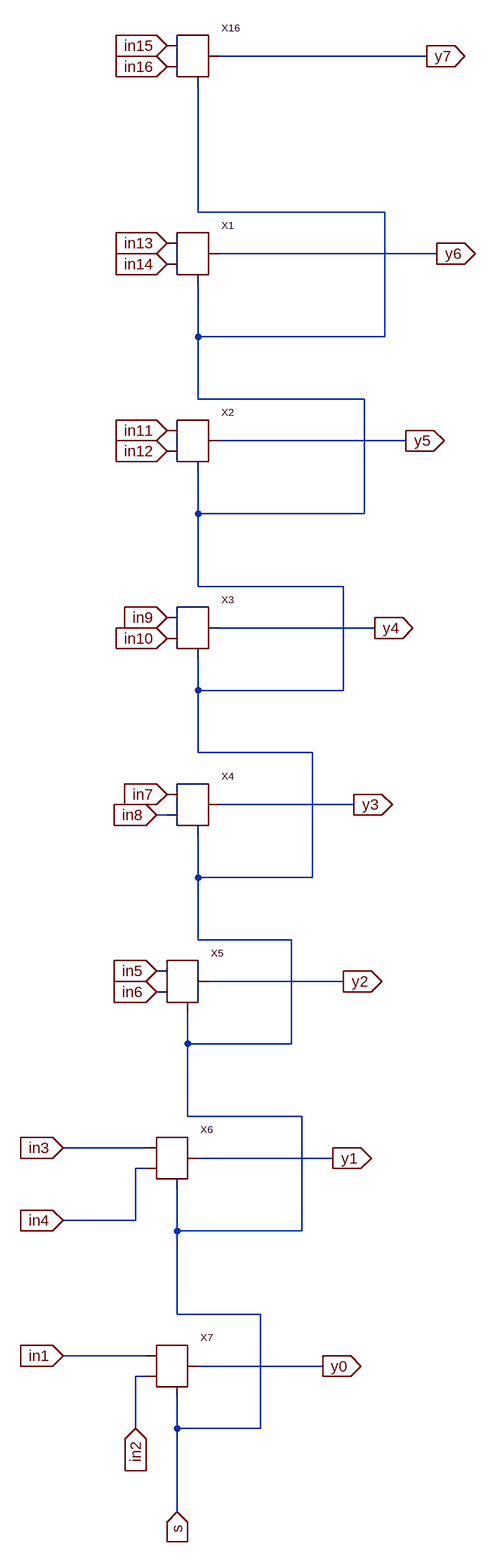
[diagram p0: schematic MUX_8input.asc]
MUX_8input.asc, the LTspice schematic file:
Version 4
SHEET 1 880 4232
WIRE 240 1872 -80 1872
WIRE -112 2112 -112 1920
WIRE 176 2112 -112 2112
WIRE 256 2176 -80 2176
WIRE -112 2304 -112 2224
WIRE 176 2304 176 2112
WIRE 176 2304 -112 2304
WIRE -112 2400 -112 2304
WIRE 144 2400 -112 2400
WIRE 208 2464 -80 2464
WIRE -112 2576 -112 2512
WIRE 144 2576 144 2400
WIRE 144 2576 -112 2576
WIRE -112 2688 -112 2576
WIRE 112 2688 -112 2688
WIRE 160 2752 -80 2752
WIRE -112 2848 -112 2800
WIRE 112 2848 112 2688
WIRE 112 2848 -112 2848
WIRE -112 2944 -112 2848
WIRE 64 2944 -112 2944
WIRE 128 3024 -80 3024
WIRE -160 3040 -176 3040
WIRE -112 3136 -112 3072
WIRE 64 3136 64 2944
WIRE 64 3136 -112 3136
WIRE -112 3232 -112 3136
WIRE 32 3232 -112 3232
WIRE 112 3296 -96 3296
WIRE -128 3392 -128 3344
WIRE 32 3392 32 3232
WIRE 32 3392 -128 3392
WIRE -128 3504 -128 3392
WIRE 48 3504 -128 3504
WIRE -192 3552 -320 3552
WIRE 96 3568 -112 3568
WIRE -192 3584 -208 3584
WIRE -208 3664 -208 3584
WIRE -208 3664 -320 3664
WIRE -144 3680 -144 3616
WIRE 48 3680 48 3504
WIRE 48 3680 -144 3680
WIRE -144 3808 -144 3680
WIRE -16 3808 -144 3808
WIRE -192 3872 -320 3872
WIRE 80 3888 -112 3888
WIRE -192 3904 -208 3904
WIRE -208 3984 -208 3904
WIRE -144 3984 -144 3936
WIRE -16 3984 -16 3808
WIRE -16 3984 -144 3984
WIRE -144 4112 -144 3984
FLAG 80 3888 y0
IOPIN 80 3888 Out
FLAG 96 3568 y1
IOPIN 96 3568 Out
FLAG 112 3296 y2
IOPIN 112 3296 Out
FLAG 128 3024 y3
IOPIN 128 3024 Out
FLAG 160 2752 y4
IOPIN 160 2752 Out
FLAG 208 2464 y5
IOPIN 208 2464 Out
FLAG 256 2176 y6
IOPIN 256 2176 Out
FLAG 240 1872 y7
IOPIN 240 1872 Out
FLAG -320 3872 in1
IOPIN -320 3872 In
FLAG -208 3984 in2
IOPIN -208 3984 In
FLAG -320 3552 in3
IOPIN -320 3552 In
FLAG -320 3664 in4
IOPIN -320 3664 In
FLAG -176 3280 in5
IOPIN -176 3280 In
FLAG -176 3312 in6
IOPIN -176 3312 In
FLAG -160 3008 in7
IOPIN -160 3008 In
FLAG -176 3040 in8
IOPIN -176 3040 In
FLAG -160 2736 in9
IOPIN -160 2736 In
FLAG -160 2768 in10
IOPIN -160 2768 In
FLAG -160 2448 in11
IOPIN -160 2448 In
FLAG -160 2480 in12
IOPIN -160 2480 In
FLAG -160 2160 in13
IOPIN -160 2160 In
FLAG -160 2192 in14
IOPIN -160 2192 In
FLAG -160 1856 in15
IOPIN -160 1856 In
FLAG -160 1888 in16
IOPIN -160 1888 In
FLAG -144 4112 s
IOPIN -144 4112 In
SYMBOL MUX_2input -80 1888 R0
SYMATTR InstName X16
SYMBOL MUX_2input -80 2192 R0
SYMATTR InstName X1
SYMBOL MUX_2input -80 2480 R0
SYMATTR InstName X2
SYMBOL MUX_2input -80 2768 R0
SYMATTR InstName X3
SYMBOL MUX_2input -80 3040 R0
SYMATTR InstName X4
SYMBOL MUX_2input -96 3312 R0
SYMATTR InstName X5
SYMBOL MUX_2input -112 3584 R0
SYMATTR InstName X6
SYMBOL MUX_2input -112 3904 R0
SYMATTR InstName X7

The netlist it stands for:
* MUX_8input.asc
XX16 in15 in16 y7 s MUX_2input  ; pins A B Y S
XX1 in13 in14 y6 s MUX_2input  ; pins A B Y S
XX2 in11 in12 y5 s MUX_2input  ; pins A B Y S
XX3 in9 in10 y4 s MUX_2input  ; pins A B Y S
XX4 in7 in8 y3 s MUX_2input  ; pins A B Y S
XX5 in5 in6 y2 s MUX_2input  ; pins A B Y S
XX6 in3 in4 y1 s MUX_2input  ; pins A B Y S
XX7 in1 in2 y0 s MUX_2input  ; pins A B Y S
.backanno
.end